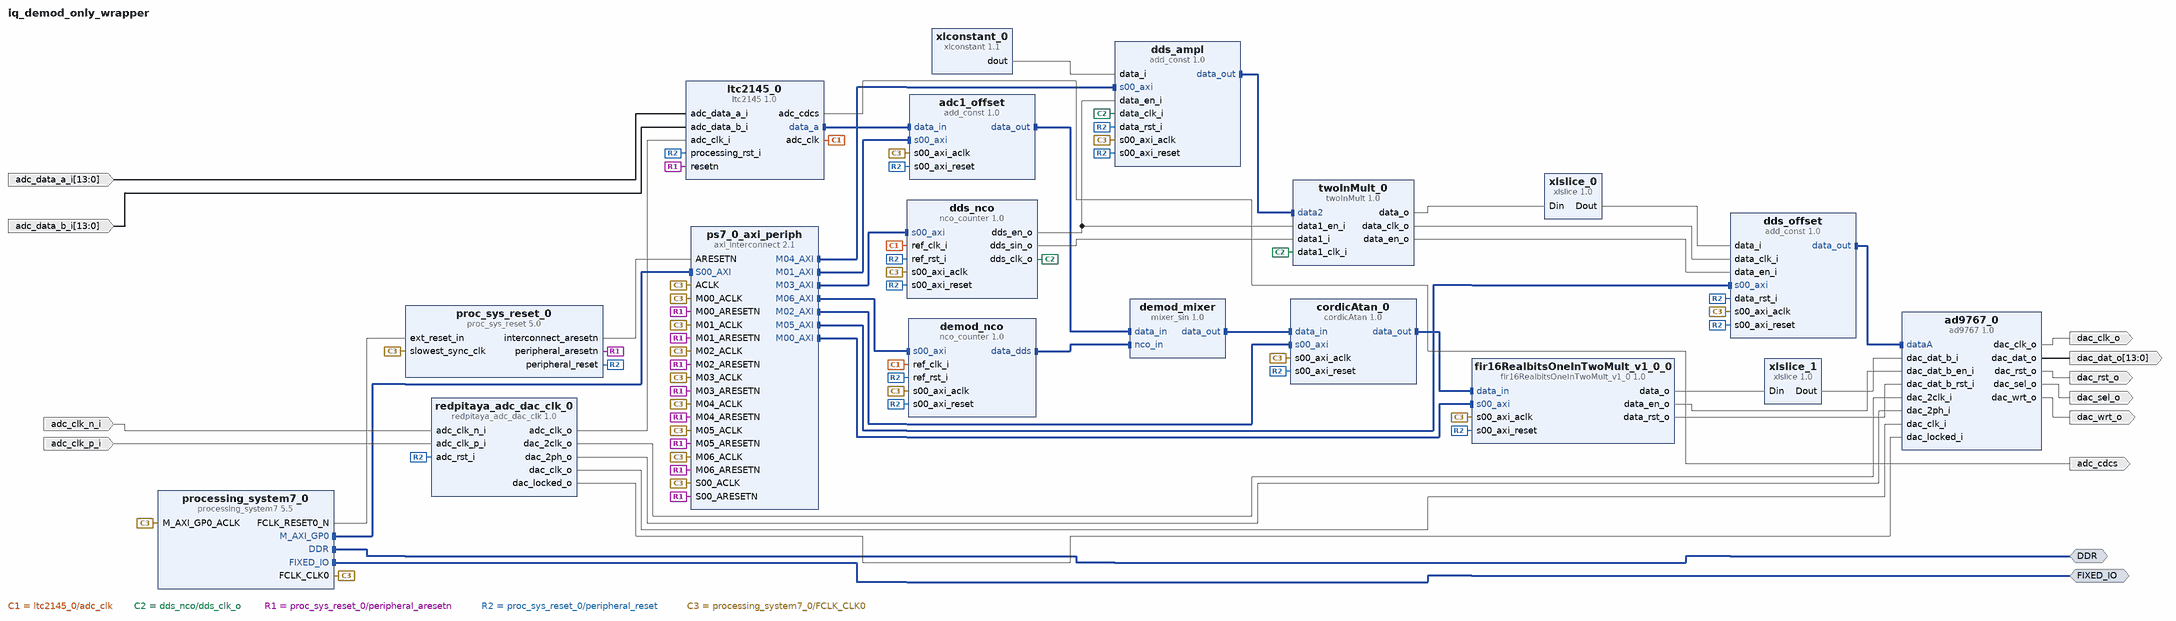
[diagram p0: block diagram of the top level]
# Vivado block design iq_demod_only_wrapper, xc7z010clg400-1, Vivado 2016.4
create_bd_design iq_demod_only_wrapper

create_bd_intf_port -mode Master -vlnv xilinx.com:interface:ddrx_rtl:1.0 DDR
create_bd_intf_port -mode Master -vlnv xilinx.com:display_processing_system7:fixedio_rtl:1.0 FIXED_IO
create_bd_port -dir O dac_clk_o
create_bd_port -dir O -from 13 -to 0 dac_dat_o
create_bd_port -dir O dac_rst_o
create_bd_port -dir O dac_sel_o
create_bd_port -dir O dac_wrt_o
create_bd_port -dir I adc_clk_n_i
create_bd_port -dir I adc_clk_p_i
create_bd_port -dir I -from 13 -to 0 adc_data_a_i
create_bd_port -dir I -from 13 -to 0 adc_data_b_i
create_bd_port -dir O adc_cdcs

create_bd_cell -type ip -vlnv ggm:cogen:ad9767:1.0 ad9767_0
create_bd_cell -type ip -vlnv ggm:cogen:add_const:1.0 adc1_offset
set_property -dict {CONFIG.DATA_OUT_SIZE 14 CONFIG.DATA_IN_SIZE 14} [get_bd_cells adc1_offset]
create_bd_cell -type ip -vlnv ggm:cogen:add_const:1.0 dds_ampl
set_property -dict {CONFIG.DATA_OUT_SIZE 14 CONFIG.DATA_IN_SIZE 14} [get_bd_cells dds_ampl]
create_bd_cell -type ip -vlnv ggm:cogen:add_const:1.0 dds_offset
set_property -dict {CONFIG.DATA_OUT_SIZE 14 CONFIG.DATA_IN_SIZE 14} [get_bd_cells dds_offset]
create_bd_cell -type ip -vlnv ggm:cogen:mixer_sin:1.0 demod_mixer
set_property -dict {CONFIG.DATA_SIZE 14 CONFIG.NCO_SIZE 14} [get_bd_cells demod_mixer]
create_bd_cell -type ip -vlnv xilinx.com:ip:proc_sys_reset:5.0 proc_sys_reset_0
create_bd_cell -type ip -vlnv xilinx.com:ip:processing_system7:5.5 processing_system7_0
create_bd_cell -type ip -vlnv xilinx.com:ip:axi_interconnect:2.1 ps7_0_axi_periph
set_property -dict {CONFIG.NUM_MI 7} [get_bd_cells ps7_0_axi_periph]
create_bd_cell -type ip -vlnv ggm:cogen:redpitaya_adc_dac_clk:1.0 redpitaya_adc_dac_clk_0
create_bd_cell -type ip -vlnv ggm:cogen:twoInMult:1.0 twoInMult_0
set_property -dict {CONFIG.DATA_SIZE 14} [get_bd_cells twoInMult_0]
create_bd_cell -type ip -vlnv xilinx.com:ip:xlconstant:1.1 xlconstant_0
set_property -dict {CONFIG.CONST_WIDTH 14 CONFIG.CONST_VAL 0} [get_bd_cells xlconstant_0]
create_bd_cell -type ip -vlnv xilinx.com:ip:xlslice:1.0 xlslice_0
set_property -dict {CONFIG.DOUT_WIDTH 14 CONFIG.DIN_TO 13 CONFIG.DIN_FROM 26 CONFIG.DIN_WIDTH 28} [get_bd_cells xlslice_0]
create_bd_cell -type ip -vlnv ggm:cogen:fir16RealbitsOneInTwoMult_v1_0:1.0 fir16RealbitsOneInTwoMult_v1_0_0
set_property -dict [list \
  CONFIG.NB_FIR 55 \
  CONFIG.NB_COEFF 55 \
  CONFIG.DECIMATE_FACTOR 1 \
  CONFIG.DATA_IN_SIZE 14 \
  CONFIG.DATA_OUT_SIZE 28 \
] [get_bd_cells fir16RealbitsOneInTwoMult_v1_0_0]
create_bd_cell -type ip -vlnv xilinx.com:ip:xlslice:1.0 xlslice_1
set_property -dict {CONFIG.DOUT_WIDTH 14 CONFIG.DIN_TO 13 CONFIG.DIN_FROM 26 CONFIG.DIN_WIDTH 28} [get_bd_cells xlslice_1]
create_bd_cell -type ip -vlnv gwbs:user:ltc2145:1.0 ltc2145_0
create_bd_cell -type ip -vlnv user.org:user:nco_counter:1.0 dds_nco
set_property -dict {CONFIG.DATA_SIZE 14 CONFIG.COUNTER_SIZE 32 CONFIG.LUT_SIZE 12} [get_bd_cells dds_nco]
create_bd_cell -type ip -vlnv user.org:user:nco_counter:1.0 demod_nco
set_property -dict {CONFIG.DATA_SIZE 14 CONFIG.COUNTER_SIZE 32 CONFIG.LUT_SIZE 12} [get_bd_cells demod_nco]
create_bd_cell -type ip -vlnv ggm:cogen:cordicAtan:1.0 cordicAtan_0
set_property -dict {CONFIG.DATA_SIZE 14 CONFIG.OUTPUT_SIZE 14} [get_bd_cells cordicAtan_0]

# ---- connections ----

connect_bd_intf_net -intf_net add_const_0_data_out [get_bd_intf_pins adc1_offset/data_out] [get_bd_intf_pins demod_mixer/data_in]
connect_bd_intf_net -intf_net add_const_2_data_out [get_bd_intf_pins dds_ampl/data_out] [get_bd_intf_pins twoInMult_0/data2]
connect_bd_intf_net [get_bd_intf_pins adc1_offset/data_in] [get_bd_intf_pins ltc2145_0/data_a]
connect_bd_intf_net -intf_net nco_counter_1_data_dds [get_bd_intf_pins demod_nco/data_dds] [get_bd_intf_pins demod_mixer/nco_in]
connect_bd_intf_net [get_bd_intf_pins processing_system7_0/M_AXI_GP0] [get_bd_intf_pins ps7_0_axi_periph/S00_AXI]
connect_bd_intf_net [get_bd_intf_pins ps7_0_axi_periph/M01_AXI] [get_bd_intf_pins adc1_offset/s00_axi]
connect_bd_intf_net [get_bd_intf_pins ps7_0_axi_periph/M03_AXI] [get_bd_intf_pins dds_nco/s00_axi]
connect_bd_intf_net [get_bd_intf_pins ps7_0_axi_periph/M04_AXI] [get_bd_intf_pins dds_ampl/s00_axi]
connect_bd_intf_net [get_bd_intf_pins ps7_0_axi_periph/M05_AXI] [get_bd_intf_pins dds_offset/s00_axi]
connect_bd_intf_net [get_bd_intf_pins ps7_0_axi_periph/M06_AXI] [get_bd_intf_pins demod_nco/s00_axi]
connect_bd_intf_net [get_bd_intf_pins ps7_0_axi_periph/M00_AXI] [get_bd_intf_pins fir16RealbitsOneInTwoMult_v1_0_0/s00_axi]
connect_bd_intf_net [get_bd_intf_pins ad9767_0/dataA] [get_bd_intf_pins dds_offset/data_out]
connect_bd_intf_net [get_bd_intf_pins ps7_0_axi_periph/M02_AXI] [get_bd_intf_pins cordicAtan_0/s00_axi]
connect_bd_intf_net [get_bd_intf_pins demod_mixer/data_out] [get_bd_intf_pins cordicAtan_0/data_in]
connect_bd_intf_net [get_bd_intf_pins cordicAtan_0/data_out] [get_bd_intf_pins fir16RealbitsOneInTwoMult_v1_0_0/data_in]
connect_bd_intf_net [get_bd_intf_ports DDR] [get_bd_intf_pins processing_system7_0/DDR]
connect_bd_intf_net [get_bd_intf_ports FIXED_IO] [get_bd_intf_pins processing_system7_0/FIXED_IO]
connect_bd_net [get_bd_pins ad9767_0/dac_clk_o] [get_bd_ports dac_clk_o]
connect_bd_net [get_bd_pins ad9767_0/dac_dat_o] [get_bd_ports dac_dat_o]
connect_bd_net [get_bd_pins ad9767_0/dac_rst_o] [get_bd_ports dac_rst_o]
connect_bd_net [get_bd_pins ad9767_0/dac_sel_o] [get_bd_ports dac_sel_o]
connect_bd_net [get_bd_pins ad9767_0/dac_wrt_o] [get_bd_ports dac_wrt_o]
connect_bd_net [get_bd_ports adc_clk_n_i] [get_bd_pins redpitaya_adc_dac_clk_0/adc_clk_n_i]
connect_bd_net [get_bd_ports adc_clk_p_i] [get_bd_pins redpitaya_adc_dac_clk_0/adc_clk_p_i]
connect_bd_net [get_bd_ports adc_data_a_i] [get_bd_pins ltc2145_0/adc_data_a_i]
connect_bd_net [get_bd_ports adc_data_b_i] [get_bd_pins ltc2145_0/adc_data_b_i]
connect_bd_net [get_bd_pins ltc2145_0/adc_cdcs] [get_bd_ports adc_cdcs]
connect_bd_net [get_bd_pins ltc2145_0/adc_clk] [get_bd_pins dds_nco/ref_clk_i] [get_bd_pins demod_nco/ref_clk_i]
connect_bd_net -net nco_counter_0_dds_clk_o [get_bd_pins dds_nco/dds_clk_o] [get_bd_pins twoInMult_0/data1_clk_i] [get_bd_pins dds_ampl/data_clk_i]
connect_bd_net -net nco_counter_0_dds_en_o [get_bd_pins dds_nco/dds_en_o] [get_bd_pins twoInMult_0/data1_en_i] [get_bd_pins dds_ampl/data_en_i]
connect_bd_net -net nco_counter_0_dds_sin_o [get_bd_pins dds_nco/dds_sin_o] [get_bd_pins twoInMult_0/data1_i]
connect_bd_net [get_bd_pins proc_sys_reset_0/interconnect_aresetn] [get_bd_pins ps7_0_axi_periph/ARESETN]
connect_bd_net [get_bd_pins proc_sys_reset_0/peripheral_aresetn] \
  [get_bd_pins ltc2145_0/resetn] [get_bd_pins ps7_0_axi_periph/S00_ARESETN] [get_bd_pins ps7_0_axi_periph/M00_ARESETN] \
  [get_bd_pins ps7_0_axi_periph/M01_ARESETN] [get_bd_pins ps7_0_axi_periph/M02_ARESETN] \
  [get_bd_pins ps7_0_axi_periph/M03_ARESETN] [get_bd_pins ps7_0_axi_periph/M04_ARESETN] \
  [get_bd_pins ps7_0_axi_periph/M05_ARESETN] [get_bd_pins ps7_0_axi_periph/M06_ARESETN]
connect_bd_net [get_bd_pins proc_sys_reset_0/peripheral_reset] \
  [get_bd_pins redpitaya_adc_dac_clk_0/adc_rst_i] [get_bd_pins adc1_offset/s00_axi_reset] \
  [get_bd_pins dds_ampl/s00_axi_reset] [get_bd_pins dds_ampl/data_rst_i] [get_bd_pins dds_offset/s00_axi_reset] \
  [get_bd_pins dds_offset/data_rst_i] [get_bd_pins fir16RealbitsOneInTwoMult_v1_0_0/s00_axi_reset] \
  [get_bd_pins ltc2145_0/processing_rst_i] [get_bd_pins dds_nco/ref_rst_i] [get_bd_pins dds_nco/s00_axi_reset] \
  [get_bd_pins demod_nco/ref_rst_i] [get_bd_pins demod_nco/s00_axi_reset] [get_bd_pins cordicAtan_0/s00_axi_reset]
connect_bd_net [get_bd_pins processing_system7_0/FCLK_CLK0] \
  [get_bd_pins processing_system7_0/M_AXI_GP0_ACLK] [get_bd_pins proc_sys_reset_0/slowest_sync_clk] \
  [get_bd_pins adc1_offset/s00_axi_aclk] [get_bd_pins dds_ampl/s00_axi_aclk] [get_bd_pins dds_offset/s00_axi_aclk] \
  [get_bd_pins fir16RealbitsOneInTwoMult_v1_0_0/s00_axi_aclk] [get_bd_pins dds_nco/s00_axi_aclk] \
  [get_bd_pins demod_nco/s00_axi_aclk] [get_bd_pins ps7_0_axi_periph/S00_ACLK] [get_bd_pins ps7_0_axi_periph/ACLK] \
  [get_bd_pins ps7_0_axi_periph/M00_ACLK] [get_bd_pins ps7_0_axi_periph/M01_ACLK] [get_bd_pins ps7_0_axi_periph/M02_ACLK] \
  [get_bd_pins ps7_0_axi_periph/M03_ACLK] [get_bd_pins ps7_0_axi_periph/M04_ACLK] [get_bd_pins ps7_0_axi_periph/M05_ACLK] \
  [get_bd_pins ps7_0_axi_periph/M06_ACLK] [get_bd_pins cordicAtan_0/s00_axi_aclk]
connect_bd_net [get_bd_pins processing_system7_0/FCLK_RESET0_N] [get_bd_pins proc_sys_reset_0/ext_reset_in]
connect_bd_net [get_bd_pins redpitaya_adc_dac_clk_0/adc_clk_o] [get_bd_pins ltc2145_0/adc_clk_i]
connect_bd_net [get_bd_pins redpitaya_adc_dac_clk_0/dac_2clk_o] [get_bd_pins ad9767_0/dac_2clk_i]
connect_bd_net [get_bd_pins redpitaya_adc_dac_clk_0/dac_2ph_o] [get_bd_pins ad9767_0/dac_2ph_i]
connect_bd_net [get_bd_pins redpitaya_adc_dac_clk_0/dac_clk_o] [get_bd_pins ad9767_0/dac_clk_i]
connect_bd_net [get_bd_pins redpitaya_adc_dac_clk_0/dac_locked_o] [get_bd_pins ad9767_0/dac_locked_i]
connect_bd_net [get_bd_pins twoInMult_0/data_clk_o] [get_bd_pins dds_offset/data_clk_i]
connect_bd_net [get_bd_pins twoInMult_0/data_en_o] [get_bd_pins dds_offset/data_en_i]
connect_bd_net [get_bd_pins twoInMult_0/data_o] [get_bd_pins xlslice_0/Din]
connect_bd_net [get_bd_pins xlconstant_0/dout] [get_bd_pins dds_ampl/data_i]
connect_bd_net [get_bd_pins xlslice_0/Dout] [get_bd_pins dds_offset/data_i]
connect_bd_net [get_bd_pins xlslice_1/Dout] [get_bd_pins ad9767_0/dac_dat_b_i]
connect_bd_net [get_bd_pins fir16RealbitsOneInTwoMult_v1_0_0/data_o] [get_bd_pins xlslice_1/Din]
connect_bd_net [get_bd_pins fir16RealbitsOneInTwoMult_v1_0_0/data_en_o] [get_bd_pins ad9767_0/dac_dat_b_en_i]
connect_bd_net [get_bd_pins fir16RealbitsOneInTwoMult_v1_0_0/data_rst_o] [get_bd_pins ad9767_0/dac_dat_b_rst_i]

# ---- address map ----
assign_bd_address -offset 0x43C00000 -range 64K -target_address_space [get_bd_addr_spaces processing_system7_0/Data] [get_bd_addr_segs fir16RealbitsOneInTwoMult_v1_0_0/s00_axi/reg0]
assign_bd_address -offset 0x43C10000 -range 64K -target_address_space [get_bd_addr_spaces processing_system7_0/Data] [get_bd_addr_segs adc1_offset/s00_axi/reg0]
assign_bd_address -offset 0x43C20000 -range 64K -target_address_space [get_bd_addr_spaces processing_system7_0/Data] [get_bd_addr_segs cordicAtan_0/s00_axi/reg0]
assign_bd_address -offset 0x43C30000 -range 64K -target_address_space [get_bd_addr_spaces processing_system7_0/Data] [get_bd_addr_segs dds_nco/s00_axi/reg0]
assign_bd_address -offset 0x43C40000 -range 64K -target_address_space [get_bd_addr_spaces processing_system7_0/Data] [get_bd_addr_segs dds_ampl/s00_axi/reg0]
assign_bd_address -offset 0x43C50000 -range 64K -target_address_space [get_bd_addr_spaces processing_system7_0/Data] [get_bd_addr_segs dds_offset/s00_axi/reg0]
assign_bd_address -offset 0x43C60000 -range 64K -target_address_space [get_bd_addr_spaces processing_system7_0/Data] [get_bd_addr_segs demod_nco/s00_axi/reg0]

validate_bd_design
save_bd_design
